# EAGLE design untitled (EAGLE 6.0)
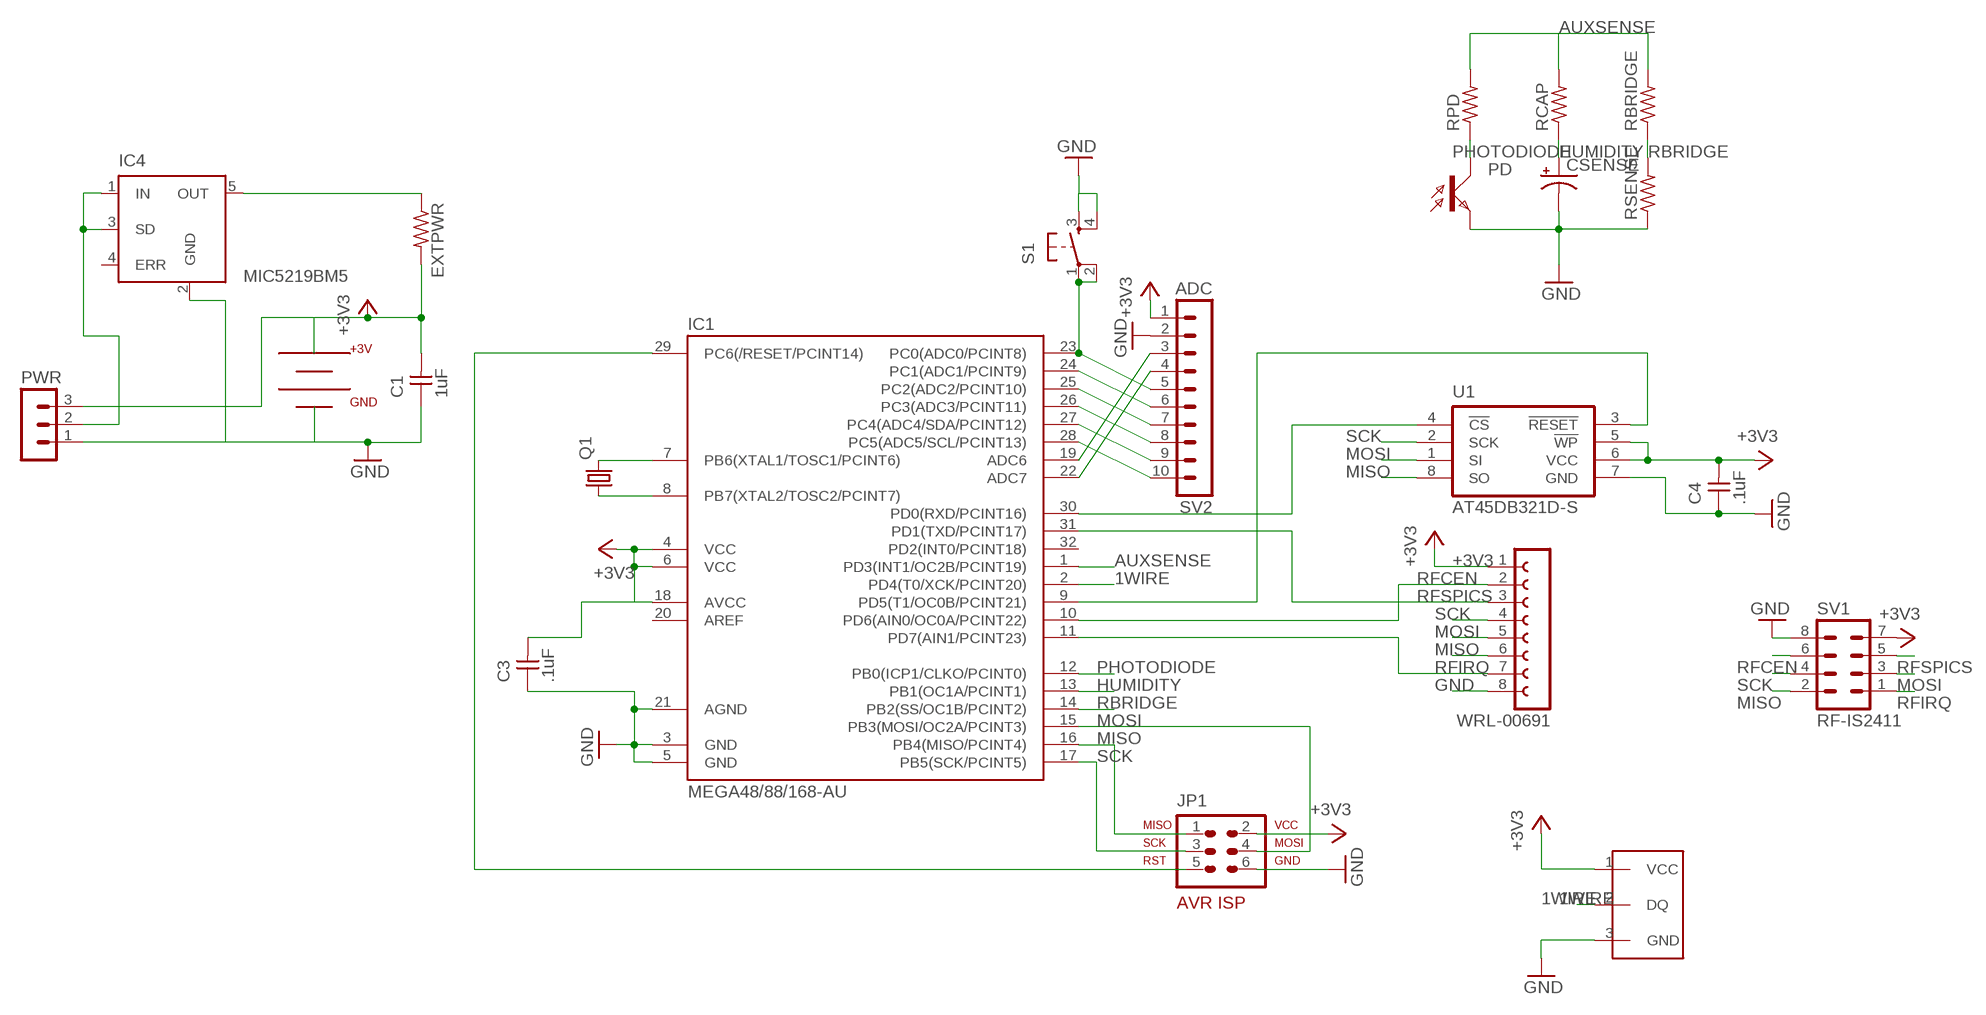
[diagram p0: schematic, sheet 1]

## Parts
C1  1uF  UNPOLARIZED_CAPACITOR1206  [1206]
C3  .1uF  UNPOLARIZED_CAPACITOR1206  [1206]
C4  .1uF  UNPOLARIZED_CAPACITOR1206  [1206]
CSENSE  CPOL-USE5-8.5  [E5-8,5]
EXTPWR  R-US_M0805  [M0805]
IC1  MEGA48/88/168-AU  [TQFP32-08]
IC4  MIC5219BM5  [SOT23-5]
JP1  AVR-ISP  AVR-ISP-6VERT  [AVR-ISP-6]
PD  PHOTOTRANSISTOR5MM  [5MM]
PWR  MA03-1  [MA03-1]
Q1  CRYSTALTC26H  [TC26H]
RBRIDGE  RESISTOR1206  [1206]
RCAP  RESISTOR1206  [1206]
RPD  RESISTOR1206  [1206]
RSENSE  R-US_0207/7  [0207/7]
S1  6MM_SWITCH6MM_SWITCH  [6MM_SWITCH]
SV1  RF-IS2411  MA04-2  [MA04-2]
SV2  ADC  MA10-1  [MA10-1]
U1  AT45DB321D-S  [SO08-8S2]
U$1  BS-7BATTERYCLIP  [BS-7PACKAGE]
U$2  DS18S20  [TO92]
WRL-00691  FE08-1  [FE08]

## Nets
1WIRE: IC1.2(PD4(T0/XCK/PCINT20)) U$2.2(DQ)
+3V3: C1.2 C3.2 C4.2 EXTPWR.2 IC1.4(VCC) IC1.6(VCC) IC1.18(AVCC) JP1.2 PWR.3 SV1.7 SV2.1 U1.5(!WP!) U1.6(VCC) U$1.POS U$2.1(VCC) WRL-00691.1
AUXSENSE: IC1.1(PD3(INT1/OC2B/PCINT19)) RBRIDGE.2 RCAP.2 RPD.2
GND: C1.1 C3.1 C4.1 CSENSE.- IC1.3(GND) IC1.5(GND) IC1.21(AGND) IC4.2(GND) JP1.6 PD.OUT(E) PWR.1 RSENSE.1 S1.3(S) S1.4(S1) SV1.8 SV2.2 U1.7(GND) U$1.NEG U$2.3(GND) WRL-00691.8
HUMIDITY: CSENSE.+ IC1.13(PB1(OC1A/PCINT1)) RCAP.1
MISO: IC1.16(PB4(MISO/PCINT4)) JP1.1 SV1.2 U1.8(SO) WRL-00691.6
MOSI: IC1.15(PB3(MOSI/OC2A/PCINT3)) JP1.4 SV1.3 U1.1(SI) WRL-00691.5
N$2: IC1.9(PD5(T1/OC0B/PCINT21)) U1.3(!RESET!)
N$3: IC1.7(PB6(XTAL1/TOSC1/PCINT6)) Q1.2
N$4: IC1.8(PB7(XTAL2/TOSC2/PCINT7)) Q1.1
N$5: EXTPWR.1 IC4.5(OUT)
N$6: IC1.23(PC0(ADC0/PCINT8)) S1.1(P) S1.2(P1) SV2.5
N$8: IC1.24(PC1(ADC1/PCINT9)) SV2.6
N$9: IC1.25(PC2(ADC2/PCINT10)) SV2.7
N$10: IC1.26(PC3(ADC3/PCINT11)) SV2.8
N$11: IC1.27(PC4(ADC4/SDA/PCINT12)) SV2.9
N$12: IC1.28(PC5(ADC5/SCL/PCINT13)) SV2.10
N$13: IC1.22(ADC7) SV2.4
N$14: IC4.1(IN) IC4.3(SD) PWR.2
N$15: IC1.19(ADC6) SV2.3
PHOTODIODE: IC1.12(PB0(ICP1/CLKO/PCINT0)) PD.IN(C) RPD.1
PORTC: IC1.30(PD0(RXD/PCINT16)) U1.4(!CS!)
RBRIDGE: IC1.14(PB2(SS/OC1B/PCINT2)) RBRIDGE.1 RSENSE.2
RESET: IC1.29(PC6(/RESET/PCINT14)) JP1.5
RFCEN: IC1.10(PD6(AIN0/OC0A/PCINT22)) SV1.6 WRL-00691.2
RFIRQ: IC1.11(PD7(AIN1/PCINT23)) SV1.1 WRL-00691.7
RFSPICS: IC1.31(PD1(TXD/PCINT17)) SV1.5 WRL-00691.3
SCK: IC1.17(PB5(SCK/PCINT5)) JP1.3 SV1.4 U1.2(SCK) WRL-00691.4
Unconnected: IC1.20(AREF) IC1.32(PD2(INT0/PCINT18)) IC4.4(ERR)

## Library data of the parts
C1 C3 C4 = ng:UNPOLARIZED_CAPACITOR: unpolarized_capacitor
CSENSE = rcl:CPOL-US: POLARIZED CAPACITOR, American symbol
EXTPWR RSENSE = rcl:R-US_: RESISTOR, American symbol
IC1 = avr-7:MEGA48/88/168
IC4 = metrify:MIC5219BM5: VOLTAGE REGULATOR; MF: ALTERA CORPORATION; MPN: MIC5219BM5 TR; OC_FARNELL: 1100656; OC_NEWARK: 09J8939
JP1 = avr-7:AVR-ISP-6: AVR ISP-6 Serial Programming Header
PD = ng:PHOTOTRANSISTOR: PHOTO TRANSISTOR
PWR = con-lstb:MA03-1: PIN HEADER; OC_FARNELL: unknown; OC_NEWARK: unknown
Q1 = crystal:CRYSTAL: CRYSTAL; OC_FARNELL: unknown; OC_NEWARK: unknown
RBRIDGE RCAP RPD = ng:RESISTOR
S1 = fab:6MM_SWITCH: OMRON SWITCH
SV1 = con-lstb:MA04-2: PIN HEADER; OC_FARNELL: unknown; OC_NEWARK: unknown
SV2 = con-lstb:MA10-1: PIN HEADER; OC_FARNELL: unknown; OC_NEWARK: unknown
U1 = memory-atmel (2):AT45DB321D-S: FLASH MEMORY 32-megabit, 2.7-volt, DataFlash®
U$1 = metrify:BS-7BATTERYCLIP
U$2 = metrify:DS18S20
WRL-00691 = con-lsta:FE08-1: FEMALE HEADER; OC_FARNELL: unknown; OC_NEWARK: unknown

## Board
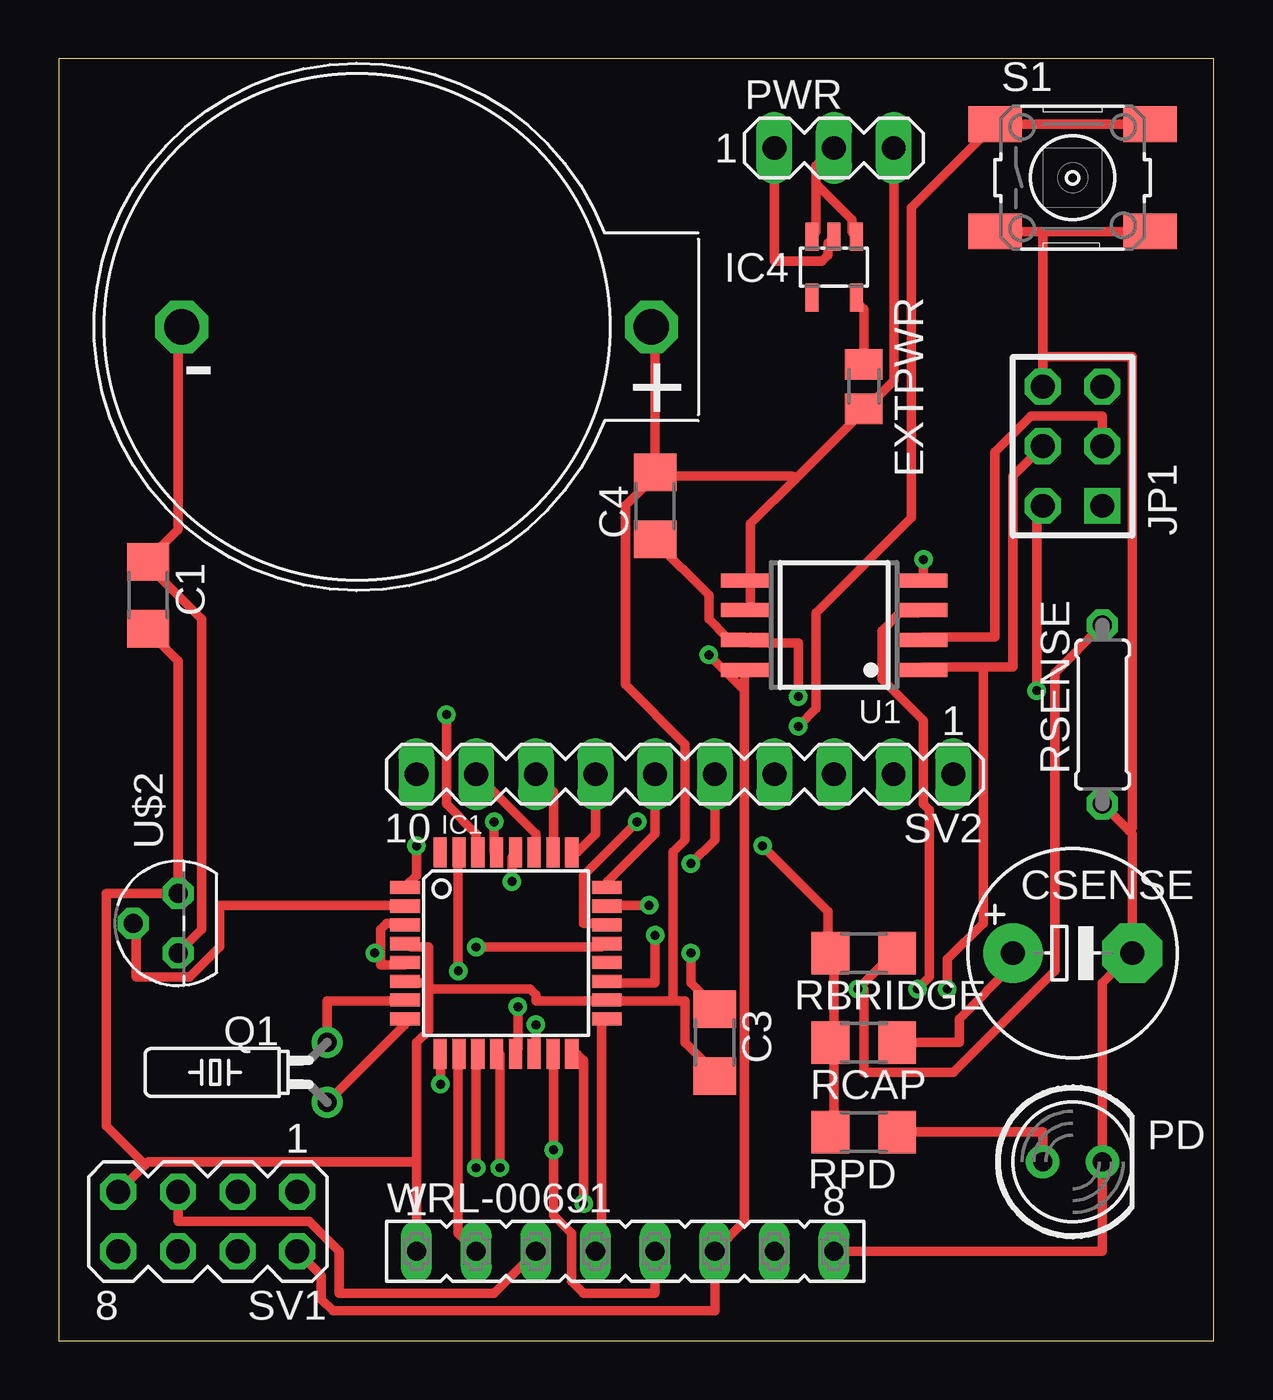
[diagram p1: board, top side]
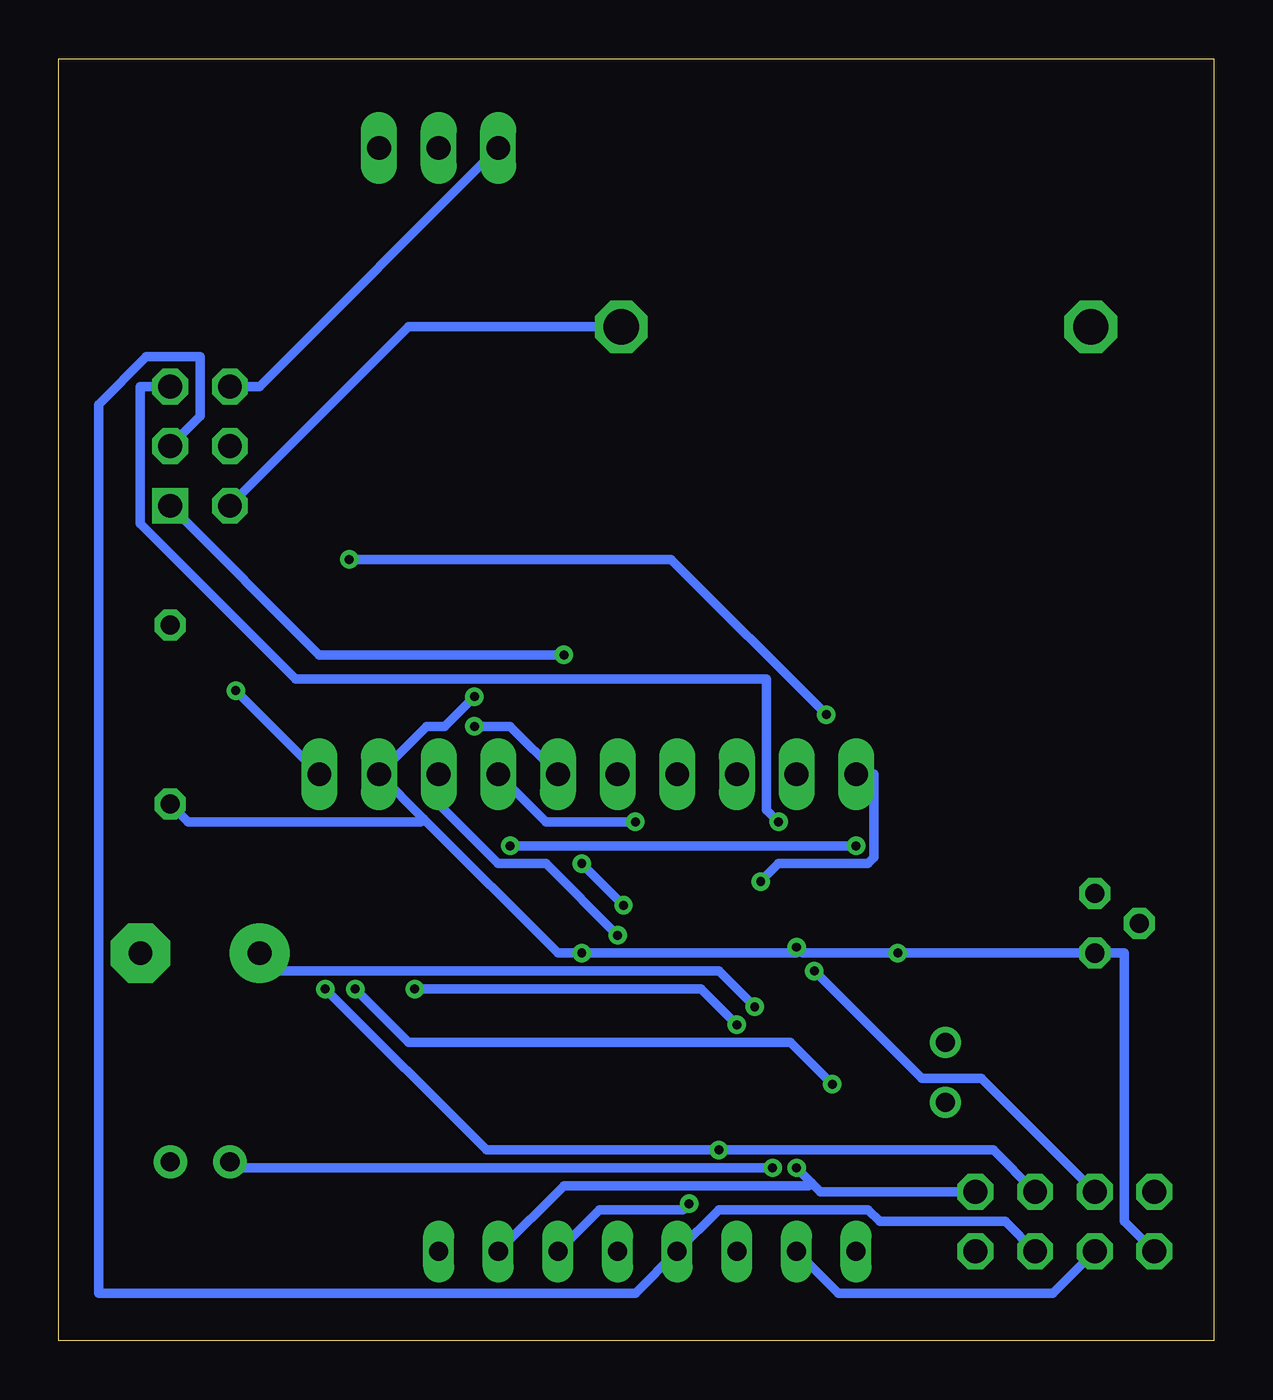
[diagram p2: board, bottom side, seen from below]

Size 49.2 x 54.6 mm. Coordinates in mm from the lower left corner, seen from the top.
Outline: 0,0 49.2,0 49.2,54.6 0,54.6 0,0
Copper layers (1*16): Top 0.035559375mm / dielectric 1.501140625mm / Bottom 0.035559375mm
Design rules: minimum track width 16mil, minimum drill 15mil, track to track 6mil, track to pad 6mil, pad to pad 6mil, via to via 6mil, smd to smd 6mil, copper to edge 15mil, drill to drill 8mil, minimum pad ring 10mil, minimum via ring 8mil, stop-mask expansion 4mil, vias tented up to drill 0mil, thermal gap 10mil

### Footprints (pad centres in the part's own frame; a part is rotated, then mirrored left to right if it is on the bottom)
1206 = smd 1.6 x 1.803: 1 -1.422,0; 2 1.422,0
E5-8,5 = drill 1.016 pad 2.54: + -2.54,0 | drill 1.016 pad 2.54 octagon: - 2.54,0
M0805 = smd 1.3 x 1.6: 1 -0.95,0; 2 0.95,0
TQFP32-08 = smd 1.27 x 0.559: 1 -4.293,2.8; 2 -4.293,2; 3 -4.293,1.2; 4 -4.293,0.4; 5 -4.293,-0.4; 6 -4.293,-1.2; 7 -4.293,-2; 8 -4.293,-2.8; 17 4.293,-2.8; 18 4.293,-2; 19 4.293,-1.2; 20 4.293,-0.4; 21 4.293,0.4; 22 4.293,1.2; 23 4.293,2; 24 4.293,2.8 | smd 0.559 x 1.27: 9 -2.8,-4.293; 10 -2,-4.293; 11 -1.2,-4.293; 12 -0.4,-4.293; 13 0.4,-4.293; 14 1.2,-4.293; 15 2,-4.293; 16 2.8,-4.293; 25 2.8,4.293; 26 2,4.293; 27 1.2,4.293; 28 0.4,4.293; 29 -0.4,4.293; 30 -1.2,4.293; 31 -2,4.293; 32 -2.8,4.293
SOT23-5 = smd 0.55 x 1.2: 1 -0.95,-1.3; 2 0,-1.3; 3 0.95,-1.3; 4 0.95,1.3; 5 -0.95,1.3
AVR-ISP-6 = drill 1.016 square: 1 -2.54,-1.27 | drill 1.016 octagon: 2 -2.54,1.27; 3 0,-1.27; 4 0,1.27; 5 2.54,-1.27; 6 2.54,1.27
5MM = drill 0.813 pad 1.422: IN -1.27,0; OUT 1.27,0
MA03-1 = drill 1.016 long: 1 -2.54,0; 2 0,0; 3 2.54,0
TC26H = drill 0.813: 1 -1.27,0; 2 1.27,0
0207/7 = drill 0.813 octagon: 1 -3.81,0; 2 3.81,0
6MM_SWITCH = smd 2.286 x 1.524: 1 -3.302,2.286; 2 3.302,2.286; 3 -3.302,-2.286; 4 3.302,-2.286
MA04-2 = drill 1.016 octagon: 1 -3.81,-1.27; 2 -3.81,1.27; 3 -1.27,-1.27; 4 -1.27,1.27; 5 1.27,-1.27; 6 1.27,1.27; 7 3.81,-1.27; 8 3.81,1.27
MA10-1 = drill 1.016 long: 1 -11.43,0; 2 -8.89,0; 3 -6.35,0; 4 -3.81,0; 5 -1.27,0; 6 1.27,0; 7 3.81,0; 8 6.35,0; 9 8.89,0; 10 11.43,0
SO08-8S2 = smd 0.6 x 2.2: 1 -1.905,-3.725; 2 -0.635,-3.725; 3 0.635,-3.725; 4 1.905,-3.725; 5 1.905,3.725; 6 0.635,3.725; 7 -0.635,3.725; 8 -1.905,3.725
BS-7PACKAGE = drill 1.5 octagon: NEG -10,0; POS 10,0
TO92 = drill 0.813 octagon: 1 1.27,0; 2 0,1.905; 3 -1.27,0
FE08 = drill 0.813 long: 1 -8.89,0; 2 -6.35,0; 3 -3.81,0; 4 -1.27,0; 5 1.27,0; 6 3.81,0; 7 6.35,0; 8 8.89,0

### Placement (x,y rotation side)
C1  3.81,31.75 270 top
C3  27.94,12.7 270 top
C4  25.4,35.56 90 top
CSENSE  43.18,16.51 0 top
EXTPWR  34.29,40.64 270 top
IC1  19.05,16.51 0 top
IC4  33.02,45.72 180 top
JP1  43.18,38.1 90 top
PD  43.18,7.62 0 top
PWR  33.02,50.8 0 top
Q1  11.43,11.43 90 top
RBRIDGE  34.29,16.51 180 top
RCAP  34.29,12.7 180 top
RPD  34.29,8.89 180 top
RSENSE  44.45,26.67 90 top
S1  43.18,49.53 0 top
SV1  6.35,5.08 180 top
SV2  26.67,24.13 180 top
U1  33.02,30.48 90 top
U$1  15.24,43.18 0 top
U$2  5.08,17.78 90 top
WRL-00691  24.13,3.81 0 top

### Tracks (layer width: path | path; a pad name or v marks a point on that pad's centre or on a via)
1WIRE
  Top 0.406: IC1.2 14.73,18.54 6.86,18.54 6.86,16.76 5.59,15.49 3.3,15.49 3.3,17.78 U$2.2
+3V3  (via drill 0.38)
  Top 0.406: v41.66,27.69 41.66,35.31 JP1.2 | 31.37,36.7 29.46,34.8 29.46,32.51 U1.5 29.46,32.26 29.46,31.24 U1.6 | 31.37,36.7 34.29,39.62 | 25.4,36.83 31.24,36.83 31.37,36.7 | PWR.3 35.56,40.89 34.29,39.62 | 34.29,39.62 EXTPWR.2 | U$1.POS 25.4,43.18 C4.2 25.4,36.83 | C1.2 3.81,30.23 5.08,28.96 U$2.1 2.03,19.05 2.03,9.14 3.68,7.49 | 26.16,14.48 26.67,14.48 26.67,12.7 27.94,11.43 C3.2 | 26.16,14.48 23.37,14.48 IC1.18 23.11,14.48 20.32,14.48 20.32,14.73 20.07,14.99 15.75,14.99 | 15.75,15.24 14.99,15.24 IC1.6 | 15.75,15.24 15.75,16.76 14.99,16.76 IC1.4 | 15.75,14.99 15.75,13.21 15.24,12.7 15.24,7.62 | 15.75,14.99 15.75,15.24 | WRL-00691.1 15.24,7.62 | 3.68,7.49 3.81,7.62 15.24,7.62 | 3.68,7.49 SV1.7 | 25.4,36.83 24.13,35.56 24.13,27.94 26.67,25.4 26.67,21.34 26.16,20.83 26.16,14.48
  Bottom 0.406: v41.66,27.69 SV2.1 | JP1.2 34.29,43.18 U$1.POS
AUXSENSE  (via drill 0.38)
  Top 0.406: 33.02,12.7 33.02,8.89 RPD.2 | v15.24,21.08 15.24,19.81 14.99,19.56 IC1.1 | v29.97,21.08 32.77,18.29 32.77,16.51 RBRIDGE.2 33.02,16.51 33.02,12.7 | 33.02,12.7 RCAP.2
  Bottom 0.406: v29.97,21.08 v15.24,21.08
GND  (via drill 0.38)
  Top 0.406: PWR.1 30.48,45.97 32.51,45.97 32.77,46.23 32.77,46.74 33.02,46.99 IC4.2 | S1.4 41.91,47.24 | 41.91,47.24 S1.3 | 41.91,47.24 41.91,41.91 | 41.91,41.91 JP1.6 | 45.59,21.72 45.72,21.59 CSENSE.- 44.45,15.24 PD.OUT 44.45,3.81 WRL-00691.8 | 45.59,21.72 RSENSE.1 | 41.91,41.91 45.72,41.91 45.72,21.84 45.59,21.72 | U$1.NEG 5.08,43.18 5.08,34.54 3.81,33.27 C1.1 3.81,33.02 6.1,30.73 6.1,17.53 U$2.3 | C4.1 25.4,34.04 27.69,31.75 27.69,30.73 28.45,29.97 29.21,29.97 U1.7 | 29.46,29.97 U1.7 | 13.72,16.51 13.72,17.53 13.97,17.78 14.73,17.78 IC1.3 | 13.72,16.51 13.72,16 14.73,16 IC1.5 | v17.78,16.76 23.11,16.76 IC1.21 | v26.92,16.51 26.92,15.24 27.94,14.22 C3.1 | v13.46,16.51 13.72,16.51 | v31.5,27.43 31.5,29.72 29.46,29.72 U1.7
  Bottom 0.406: PWR.1 40.64,40.64 JP1.6 | SV1.8 3.81,5.08 3.81,16.51 U$2.3 v13.46,16.51 17.53,16.51 v17.78,16.76 17.78,16.51 v26.92,16.51 27.94,16.51 33.66,22.23 | 33.66,22.23 SV2.2 33.53,26.16 32.77,26.16 v31.5,27.43 | RSENSE.1 43.69,22.1 33.78,22.1 33.66,22.23
HUMIDITY  (via drill 0.38)
  Top 0.406: v19.56,14.22 19.56,12.45 IC1.13 | RCAP.1 38.35,12.7 38.35,13.72 40.64,16 CSENSE.+
  Bottom 0.406: v19.56,14.22 21.08,15.75 39.88,15.75 CSENSE.+
MISO  (via drill 0.38)
  Top 0.406: v22.35,5.84 22.35,11.94 22.1,12.19 IC1.16 | 29.21,27.69 29.21,5.08 WRL-00691.6 27.94,1.27 11.68,1.27 11.18,1.78 11.18,2.79 SV1.2 | 29.21,27.69 29.21,28.45 U1.8 | 29.21,27.69 v27.69,29.21
  Bottom 0.406: v22.35,5.84 22.61,5.59 26.16,5.59 WRL-00691.6 | JP1.1 38.1,29.21 v27.69,29.21
MOSI  (via drill 0.38)
  Top 0.406: 39.37,28.7 40.64,28.7 40.64,36.83 JP1.4 | 39.37,28.7 36.83,28.7 U1.1 | WRL-00691.5 25.4,2.03 22.35,2.03 21.84,2.54 21.84,4.57 21.08,5.33 v21.08,8.13 21.08,12.19 IC1.15 | 39.37,28.7 39.37,17.78 37.85,16.26 v37.85,14.99
  Bottom 0.406: SV1.3 9.4,8.13 v21.08,8.13 30.99,8.13 v37.85,14.99
N$2  (via drill 0.38)
  Top 0.406: v16.26,10.92 16.26,12.19 IC1.9 | v36.58,14.99 37.08,15.49 37.08,22.61 36.83,22.86 36.83,26.42 35.05,28.19 35.05,30.23 35.81,30.99 36.58,30.99 U1.3
  Bottom 0.406: v16.26,10.92 18.03,12.7 34.29,12.7 v36.58,14.99
N$3
  Top 0.406: Q1.2 11.43,14.48 14.73,14.48 IC1.7
N$4
  Top 0.406: Q1.1 14.73,13.46 IC1.8
N$5
  Top 0.406: EXTPWR.1 34.29,43.94 34.04,44.2 IC4.5
N$6  (via drill 0.38)
  Top 0.406: S1.2 S1.1 36.32,48.26 36.32,35.05 32.26,30.99 32.26,26.92 v31.5,26.16 | v25.15,18.54 23.37,18.54 IC1.23 | v26.92,20.32 27.94,21.34 SV2.5
  Bottom 0.406: v26.92,20.32 v25.15,18.54 | v31.5,26.16 29.97,26.16 SV2.5
N$8
  Top 0.406: SV2.6 25.4,21.59 23.37,19.56 IC1.24
N$9
  Top 0.406: SV2.7 22.86,21.59 22.1,20.83 IC1.25
N$10
  Top 0.406: SV2.8 21.08,23.37 21.08,20.83 IC1.26
N$11
  Top 0.406: SV2.9 20.32,21.59 20.32,20.83 IC1.27
N$12  (via drill 0.38)
  Top 0.406: v19.3,19.56 19.3,20.57 IC1.28
  Bottom 0.406: v19.3,19.56 18.54,20.32 14.73,20.32 14.48,20.57 14.48,24.13 SV2.10
N$13  (via drill 0.38)
  Top 0.406: v24.64,22.1 22.35,19.81 22.35,17.78 23.11,17.78 IC1.22
  Bottom 0.406: v24.64,22.1 28.45,22.1 SV2.4
N$14
  Top 0.406: 32.26,49.28 32.26,50.04 PWR.2 | 32.26,49.28 32.26,47.24 IC4.3 | 32.26,49.28 33.78,47.75 33.78,47.24 IC4.1
N$15  (via drill 0.38)
  Top 0.406: v25.4,17.27 25.4,15.24 23.37,15.24 IC1.19
  Bottom 0.406: v25.4,17.27 28.45,20.32 30.48,20.32 33.02,22.86 SV2.3
PHOTODIODE  (via drill 0.38)
  Top 0.406: v18.8,7.37 18.8,12.19 IC1.12 | RPD.1 41.91,8.89 PD.IN
  Bottom 0.406: v18.8,7.37 41.66,7.37 PD.IN
PORTC  (via drill 0.38)
  Top 0.406: v16.51,26.67 16.51,22.86 17.78,21.59 17.78,20.83 IC1.30 | v36.83,33.27 36.83,32.51 U1.4
  Bottom 0.406: v16.51,26.67 23.11,33.27 v36.83,33.27
RBRIDGE  (via drill 0.38)
  Top 0.406: v20.32,13.46 20.32,12.45 IC1.14 | RBRIDGE.1 35.56,16.51 v34.04,14.99 34.29,14.99 34.29,11.43 38.1,11.43 42.42,15.75 42.42,28.45 RSENSE.2
  Bottom 0.406: v20.32,13.46 21.84,14.99 v34.04,14.99
RESET  (via drill 0.38)
  Top 0.406: v18.54,22.1 18.54,20.83 IC1.29
  Bottom 0.406: v18.54,22.1 19.05,22.61 19.05,28.19 39.12,28.19 45.72,34.8 45.72,40.64 JP1.5
RFCEN
  Top 0.406: WRL-00691.2 17.02,4.57 17.02,12.19 IC1.10
  Bottom 0.406: SV1.6 6.86,2.03 16,2.03 WRL-00691.2
RFIRQ  (via drill 0.38)
  Top 0.406: v17.78,7.37 17.78,12.19 IC1.11
  Bottom 0.406: 17.14,6.73 16.76,6.35 SV1.1 | 17.14,6.73 v17.78,7.37 | WRL-00691.7 27.69,6.6 17.27,6.6 17.14,6.73
RFSPICS  (via drill 0.38)
  Top 0.406: v17.02,15.75 17.02,20.57 IC1.31 | WRL-00691.3 18.54,2.03 11.94,2.03 11.94,3.81 10.67,5.08 5.08,5.08 SV1.5
  Bottom 0.406: v17.02,15.75 12.45,11.18 9.91,11.18 SV1.5
SCK
  Top 0.406: JP1.3 44.45,39.37 41.4,39.37 39.88,37.85 39.88,29.97 36.83,29.97 U1.2 | WRL-00691.4 23.11,4.06 23.11,13.46 IC1.17
  Bottom 0.406: SV1.4 8.89,5.08 14.22,5.08 14.73,5.59 21.08,5.59 WRL-00691.4 24.64,2.03 47.5,2.03 47.5,39.88 45.47,41.91 43.18,41.91 43.18,39.37 JP1.3

### Text on the board
Document: A5 | A4 | A3 | A2 | A1 | A0 | A7 | A6 | - | 3v